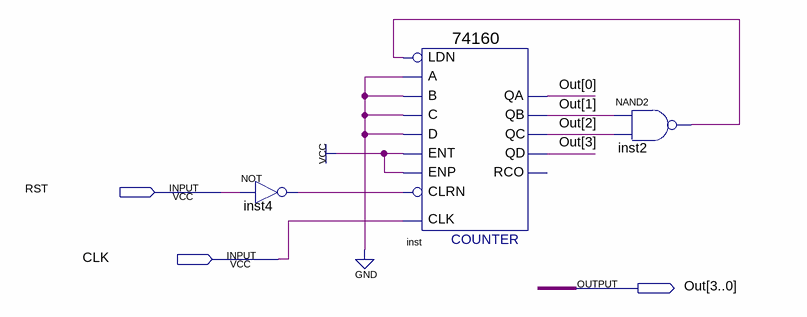
[diagram p0: schematic sheet]
// Quartus schematic Cnt_7.bdf as structural Verilog: 3 symbols, 3 pins
module Cnt_7 (
  input  RST,
  input  CLK,
  output [3:0] Out
);

  wire inst2_out, inst4_out;

  not inst4 (inst4_out, RST);
  \74160  inst (
    .CLK(CLK), .ENT(1'b1), .A(1'b0), .B(1'b0), .C(1'b0), .D(1'b0), .LDN(inst2_out), .ENP(1'b1),
    .CLRN(inst4_out), .QD(Out[3]), .QA(Out[0]), .QB(Out[1]), .QC(Out[2]));  // open: RCO
  nand inst2 (inst2_out, Out[1], Out[2]);
endmodule
